# EAGLE schematic attiny_rc_switch_th_schematic (EAGLE 9.7.0)
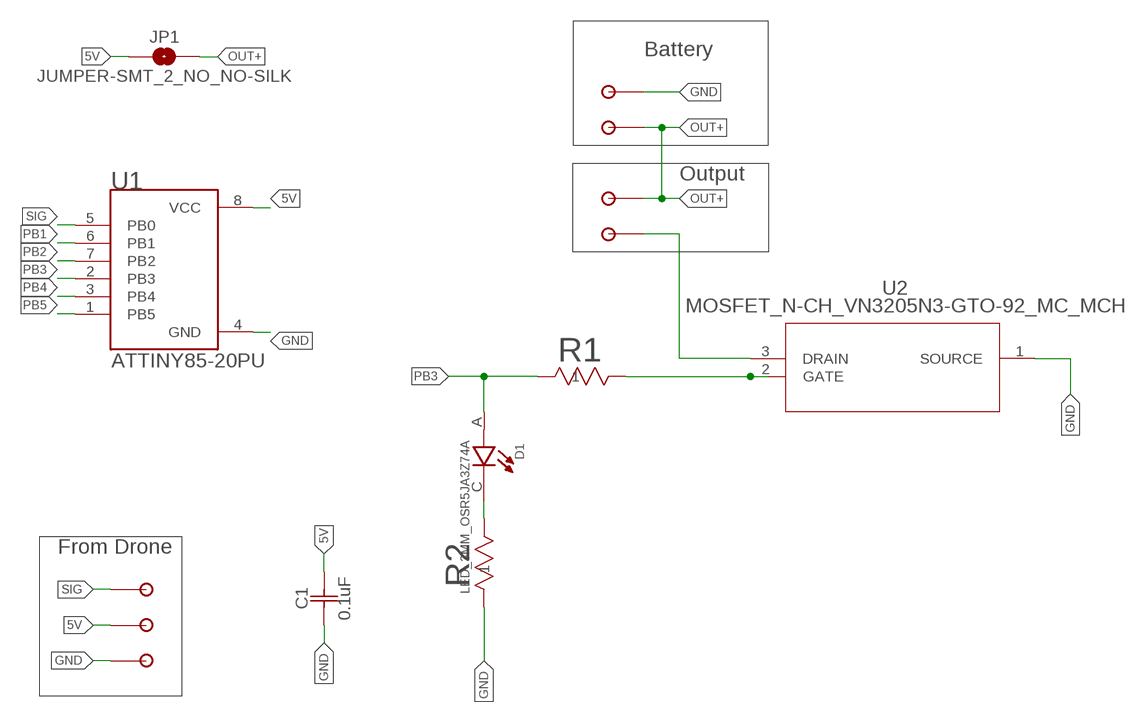
[diagram p0: schematic, sheet 1]

## Parts
C1  0.1uF  CAPACITOR_CERAMIC_50V_K10XK10X7RF5UH5K103K10X7RF5UH5_VIS  [K10XK10X7RF5UH5]
D1  LED_3MM_OSR5JA3Z74A  [OSR5JA3Z74A]
JP1  JUMPER-SMT_2_NO_NO-SILK  [SMT-JUMPER_2_NO_NO-SILK]
R1  RESISTOR_1/8W_CF18JTSTA_CF18_STP  [RESISTOR_1/8W_CF18JT]
R2  RESISTOR_1/8W_CF18JTSTA_CF18_STP  [RESISTOR_1/8W_CF18JT]
U1  ATTINY85-20PU  [ATTINY85-20PU]
U2  MOSFET_N-CH_VN3205N3-GTO-92_MC_MCH  [MOSFET_N-CH_VN3205N3-G]
U$1  SMD_PAD_NO_STENCIL  [SMD_PAD_NO_STENCIL]
U$2  SMD_PAD_NO_STENCIL  [SMD_PAD_NO_STENCIL]
U$3  SMD_PAD_NO_STENCIL  [SMD_PAD_NO_STENCIL]
U$4  SMD_PAD_NO_STENCIL  [SMD_PAD_NO_STENCIL]
U$5  SMD_PAD_NO_STENCIL  [SMD_PAD_NO_STENCIL]
U$6  SMD_PAD_NO_STENCIL  [SMD_PAD_NO_STENCIL]
U$7  SMD_PAD_NO_STENCIL  [SMD_PAD_NO_STENCIL]

## Nets
5V: C1.2 JP1.1 U1.8(VCC) U$1.P$1
GND: C1.1 R2.1 U1.4(GND) U2.1(SOURCE) U$2.P$1 U$6.P$1
N$2: R1.2 U2.2(GATE)
N$3: D1.C R2.2
OUT+: JP1.2 U$4.P$1 U$5.P$1
OUT-: U2.3(DRAIN) U$3.P$1
PB1: U1.6(PB1)
PB2: U1.7(PB2)
PB3: D1.A R1.1 U1.2(PB3)
PB4: U1.3(PB4)
PB5: U1.1(PB5)
SIG: U1.5(PB0) U$7.P$1

## Notes on the sheet
- Battery
- Output
- From Drone

## Library data of the parts
C1 = scotts-library:CAPACITOR_CERAMIC_50V_K10XK10X7RF5UH5; COPYRIGHT: Copyright (C) 2024 Ultra Librarian. All rights reserved.; MANUFACTURER_PART_NUMBER: K103K10X7RF5UH5; MFR_NAME: Vishay; TYPE: Ceramic Capacitor
D1 = scotts-library:LED_3MM_OSR5JA3Z74A: Check availability <https://pricing.snapeda.com/parts/OSR5JA3Z74A/optosupply/view-part?ref=eda>; AVAILABILITY: In Stock; CHECK_PRICES: https://www.snapeda.com/parts/OSR5JA3Z74A/OptoSupply/view-part/?ref=eda; DESCRIPTION: LED; 3mm; red; 220÷330mcd; 70°; Front: convex; Pitch: 2.54mm; MF: optosupply; MP: OSR5JA3Z74A; PACKAGE: None; PRICE: None; SNAPEDA_LINK: https://www.snapeda.com/parts/OSR5JA3Z74A/OptoSupply/view-part/?ref=snap
JP1 = SparkFun-Jumpers:JUMPER-SMT_2_NO: Normally open jumper This jumper has two pads in close proximity to each other. Apply solder to close the connection. Round pads are easier to solder for beginners, but are a lot larger. SparkFun Product that uses the round pads: SparkFun EL Sequencer <https://www.sparkfun.com/products/12781>
R1 R2 = scotts-library:RESISTOR_1/8W_CF18JT; COPYRIGHT: Copyright (C) 2025 Ultra Librarian. All rights reserved.; MANUFACTURER_PART_NUMBER: CF18JT100K; MFR_NAME: Stackpole International
U1 = scotts-library:ATTINY85-20PU; MANUFACTURER: Atmel
U2 = scotts-library:MOSFET_N-CH_VN3205N3-G; COPYRIGHT: Copyright (C) 2025 Ultra Librarian. All rights reserved.; MANUFACTURER_PART_NUMBER: VN3205N3-G; MFR_NAME: Microchip
U$1-U$7 = scotts-library:SMD_PAD_NO_STENCIL